# EAGLE design power (EAGLE 6.4)
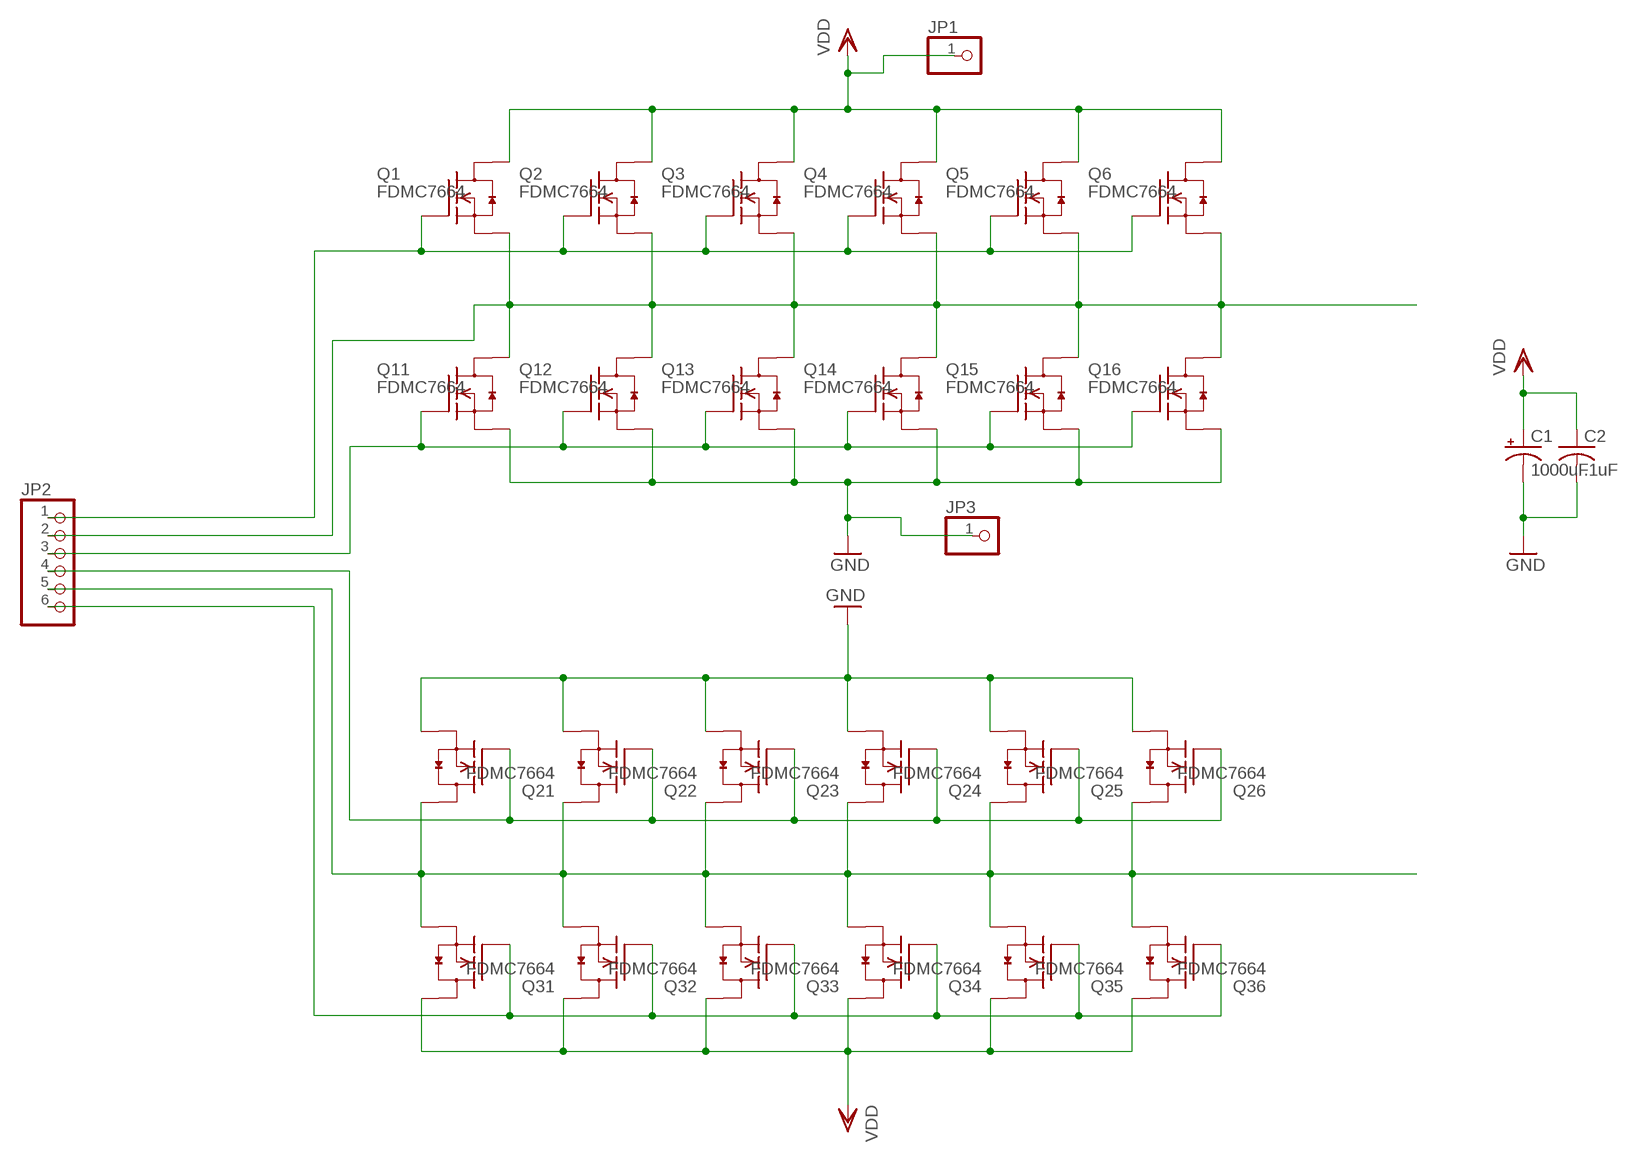
[diagram p0: schematic, sheet 1]

## Parts
C1  1000uF  CPOL-US140CLH-0810  [140CLH-0810]
C2  .1uF  C-USC0603  [C0603]
JP1  PINHD-1X1  [1X01]
JP2  PINHD-1X6  [1X06]
JP3  PINHD-1X1  [1X01]
Q1  FDMC7664  [MLP33]
Q2  FDMC7664  [MLP33]
Q3  FDMC7664  [MLP33]
Q4  FDMC7664  [MLP33]
Q5  FDMC7664  [MLP33]
Q6  FDMC7664  [MLP33]
Q11  FDMC7664  [MLP33]
Q12  FDMC7664  [MLP33]
Q13  FDMC7664  [MLP33]
Q14  FDMC7664  [MLP33]
Q15  FDMC7664  [MLP33]
Q16  FDMC7664  [MLP33]
Q21  FDMC7664  [MLP33]
Q22  FDMC7664  [MLP33]
Q23  FDMC7664  [MLP33]
Q24  FDMC7664  [MLP33]
Q25  FDMC7664  [MLP33]
Q26  FDMC7664  [MLP33]
Q31  FDMC7664  [MLP33]
Q32  FDMC7664  [MLP33]
Q33  FDMC7664  [MLP33]
Q34  FDMC7664  [MLP33]
Q35  FDMC7664  [MLP33]
Q36  FDMC7664  [MLP33]

## Nets
GND: C1.- C2.2 JP3.1 Q11.123S(S) Q12.123S(S) Q13.123S(S) Q14.123S(S) Q15.123S(S) Q16.123S(S) Q21.123S(S) Q22.123S(S) Q23.123S(S) Q24.123S(S) Q25.123S(S) Q26.123S(S)
HO_1: JP2.1 Q1.4G(G) Q2.4G(G) Q3.4G(G) Q4.4G(G) Q5.4G(G) Q6.4G(G)
HO_2: JP2.6 Q31.4G(G) Q32.4G(G) Q33.4G(G) Q34.4G(G) Q35.4G(G) Q36.4G(G)
LO_1: JP2.3 Q11.4G(G) Q12.4G(G) Q13.4G(G) Q14.4G(G) Q15.4G(G) Q16.4G(G)
LO_2: JP2.4 Q21.4G(G) Q22.4G(G) Q23.4G(G) Q24.4G(G) Q25.4G(G) Q26.4G(G)
MOTOR_OUT_1: JP2.2 Q1.123S(S) Q2.123S(S) Q3.123S(S) Q4.123S(S) Q5.123S(S) Q6.123S(S) Q11.5678D(D) Q12.5678D(D) Q13.5678D(D) Q14.5678D(D) Q15.5678D(D) Q16.5678D(D)
MOTOR_OUT_2: JP2.5 Q21.5678D(D) Q22.5678D(D) Q23.5678D(D) Q24.5678D(D) Q25.5678D(D) Q26.5678D(D) Q31.123S(S) Q32.123S(S) Q33.123S(S) Q34.123S(S) Q35.123S(S) Q36.123S(S)
VDD: C1.+ C2.1 JP1.1 Q1.5678D(D) Q2.5678D(D) Q3.5678D(D) Q4.5678D(D) Q5.5678D(D) Q6.5678D(D) Q31.5678D(D) Q32.5678D(D) Q33.5678D(D) Q34.5678D(D) Q35.5678D(D) Q36.5678D(D)

## Library data of the parts
C1 = rcl:CPOL-US: POLARIZED CAPACITOR, American symbol
C2 = rcl:C-US: CAPACITOR, American symbol
JP1 JP3 = pinhead:PINHD-1X1: PIN HEADER
JP2 = pinhead:PINHD-1X6: PIN HEADER
Q1-Q6 Q11-Q16 Q21-Q26 Q31-Q36 = open-bldc:FDMC7664

## Board
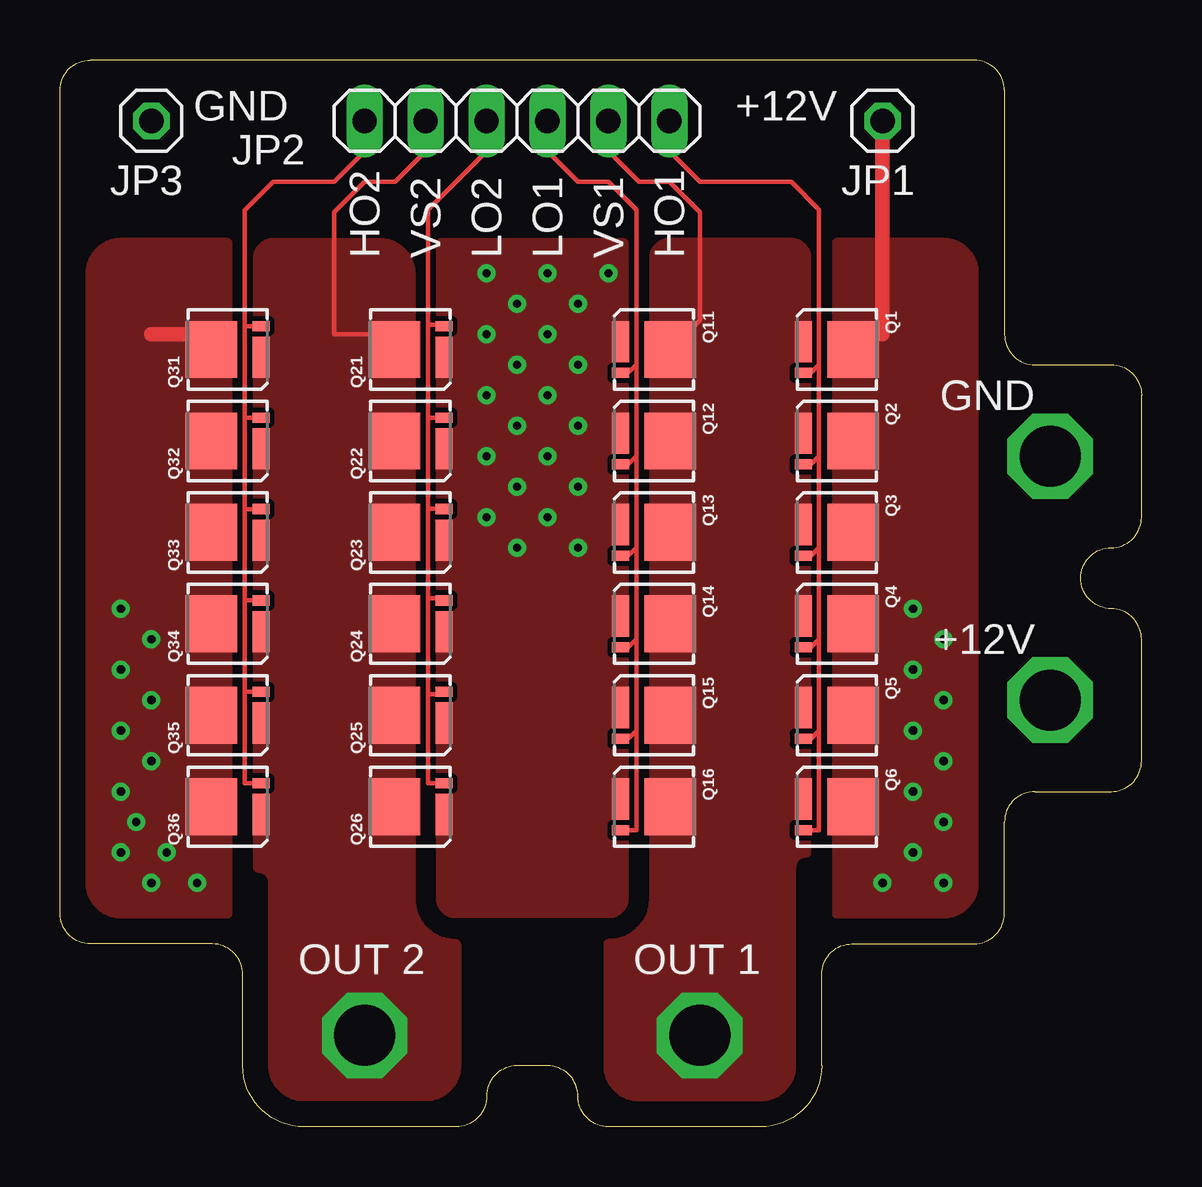
[diagram p1: board, top side]
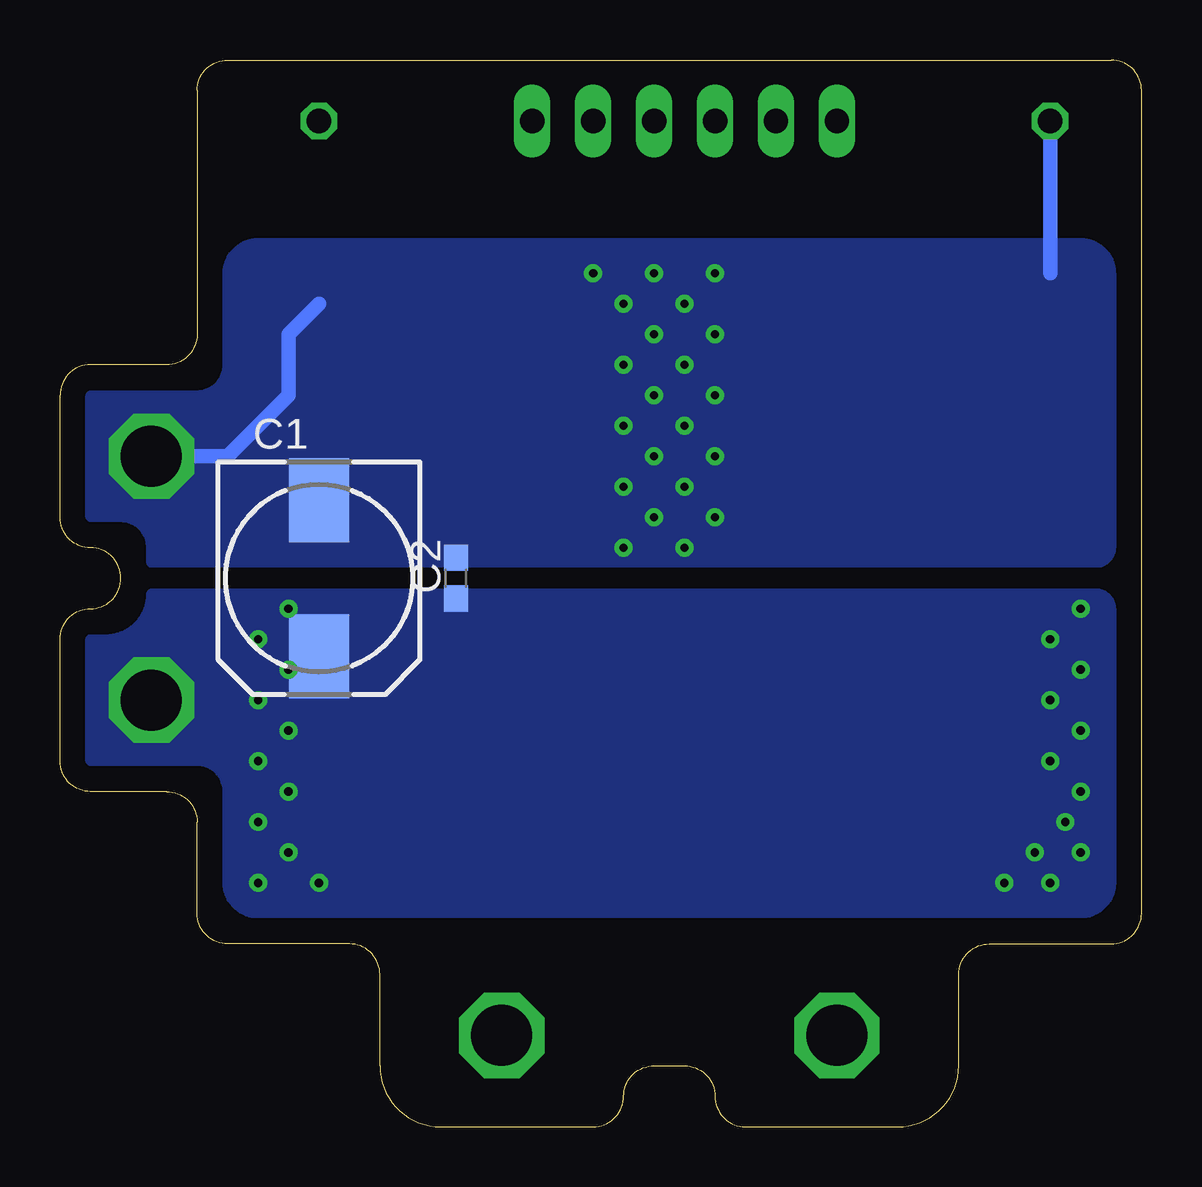
[diagram p2: board, bottom side, seen from below]

Size 45.09 x 44.45 mm. Coordinates in mm from the lower left corner, seen from the top.
Outline: 38.1,44.45 1.27,44.45 arc90 0,43.18 0,8.89 arc90 1.27,7.62 6.35,7.62 arc-90 7.62,6.35 7.62,2.54 arc90 10.16,0 16.51,0 arc90 17.78,1.27 arc-90 19.05,2.54 20.32,2.54 arc-90 21.59,1.27 arc90 22.86,0 29.21,0 arc90 31.75,2.54 31.75,6.35 arc-90 33.02,7.62 38.1,7.62 arc90 39.37,8.89 39.37,12.7 arc-90 40.64,13.97 43.82,13.97 arc90 45.09,15.24 45.09,20.32 arc90 43.82,21.59 arc-90 42.54,22.86 arc-90 43.82,24.13 arc90 45.09,25.4 45.09,30.48 arc90 43.82,31.75 40.64,31.75 arc-90 39.37,33.02 39.37,43.18 arc90 38.1,44.45
Copper layers (1*16): Top 0.035mm / dielectric 1.5mm / Bottom 0.035mm
Design rules "default *": minimum track width 10mil, minimum drill 24mil, track to track 8mil, track to pad 8mil, pad to pad 8mil, via to via 8mil, smd to smd 8mil, copper to edge 40mil, drill to drill 8mil, minimum pad ring 10mil, minimum via ring 8mil, stop-mask expansion 4mil, vias tented up to drill 25mil, thermal gap 10mil

### Footprints (pad centres in the part's own frame; a part is rotated, then mirrored left to right if it is on the bottom)
140CLH-0810 = smd 3.5 x 2.5: + 3.25,0; - -3.25,0
C0603 = smd 1.1 x 1: 1 -0.85,0; 2 0.85,0
1X01 = drill 1.016 octagon: 1 0,0
1X06 = drill 1.016 long: 1 -6.35,0; 2 -3.81,0; 3 -1.27,0; 4 1.27,0; 5 3.81,0; 6 6.35,0
MLP33 = smd 0.42 x 0.7: 4G 0.975,-1.4 | smd 1.72 x 0.7: 123S -0.325,-1.4 | smd 2.37 x 2.15: 5678D 0,0.675

### Placement (x,y rotation side)
C1  34.29,22.86 270 bottom
C2  28.58,22.86 90 bottom
JP1  34.29,41.91 180 top
JP2  19.05,41.91 180 top
JP3  3.81,41.91 180 top
Q1  32.38,32.38 270 top
Q2  32.38,28.57 270 top
Q3  32.38,24.77 270 top
Q4  32.38,20.95 270 top
Q5  32.38,17.14 270 top
Q6  32.38,13.34 270 top
Q11  24.77,32.38 270 top
Q12  24.77,28.57 270 top
Q13  24.77,24.77 270 top
Q14  24.77,20.95 270 top
Q15  24.77,17.14 270 top
Q16  24.77,13.34 270 top
Q21  14.61,32.38 90 top
Q22  14.61,28.57 90 top
Q23  14.61,24.77 90 top
Q24  14.61,20.95 90 top
Q25  14.61,17.14 90 top
Q26  14.61,13.34 90 top
Q31  6.98,32.38 90 top
Q32  6.98,28.57 90 top
Q33  6.98,24.77 90 top
Q34  6.98,20.95 90 top
Q35  6.98,17.14 90 top
Q36  6.98,13.34 90 top

### Tracks (layer width: path | path; a pad name or v marks a point on that pad's centre or on a via)
GND  (via drill 0.34, 2.54)
  Bottom 0.61: 34.29,34.29 35.56,33.02 35.56,30.48 38.1,27.94 v41.27,27.94 | JP3.1 3.81,35.56
  other vias: 21.59,24.13 19.05,24.13 20.32,25.4 17.78,25.4 21.59,26.67 19.05,26.67 20.32,27.94 17.78,27.94 19.05,29.21 21.59,29.21 20.32,30.48 17.78,30.48 21.59,31.75 19.05,31.75 20.32,33.02 17.78,33.02 21.59,34.29 19.05,34.29 22.86,35.56 20.32,35.56 17.78,35.56
  pour Bottom (no thermals): 43.82,30.48 39.37,30.48 arc-90 38.1,31.75 38.1,35.56 arc90 36.83,36.83 2.54,36.83 arc90 1.27,35.56 1.27,24.13 arc90 1.91,23.49 41.27,23.49 41.27,24.13 arc-90 42.54,25.4 43.82,25.4
  pour Top (no thermals): 23.49,36.83 23.49,9.53 arc-90 22.86,8.89 16.51,8.89 arc-90 15.88,9.53 15.88,36.83
HO_1
  Top 0.178: Q6.4G 31.65,12.36 31.65,16.51 | 31.65,16.51 31.65,20.32 | 31.65,20.32 31.65,24.13 | 31.65,24.13 31.65,27.94 | 31.65,27.94 31.65,31.75 | 31.65,31.75 31.65,38.2 30.48,39.37 26.67,39.37 25.4,40.64 JP2.1 | Q5.4G 31.3,16.17 31.65,16.51 | Q4.4G 31.3,19.98 31.65,20.32 | Q3.4G 31.3,23.79 31.65,24.13 | Q2.4G 31.3,27.6 31.65,27.94 | Q1.4G 31.3,31.41 31.65,31.75
HO_2
  Top 0.178: Q36.4G 7.7,14.31 7.7,17.78 7.7,18.12 | 7.7,18.12 7.7,21.93 | 7.7,21.93 7.7,25.74 | 7.7,25.74 7.7,29.55 | 7.7,29.55 7.7,33.36 | 7.7,33.36 7.7,38.19 8.89,39.37 11.43,39.37 12.7,40.64 JP2.6 | Q31.4G 7.7,33.36 | Q32.4G 7.7,29.55 | Q33.4G 7.7,25.74 | Q34.4G 7.7,21.93 | Q35.4G 7.7,18.12
LO_1
  Top 0.178: Q16.4G 24.02,12.36 24.02,16.51 | 24.02,16.51 24.02,20.32 | 24.02,20.32 24.02,24.13 | 24.02,24.13 24.02,27.94 | 24.02,27.94 24.02,31.75 | 24.02,31.75 24.02,38.2 22.86,39.37 21.59,39.37 20.32,40.64 JP2.3 | Q15.4G 23.69,16.17 24.02,16.51 | Q14.4G 23.69,19.98 24.02,20.32 | Q13.4G 23.69,23.79 24.02,24.13 | Q12.4G 23.69,27.6 24.02,27.94 | Q11.4G 23.69,31.41 24.02,31.75
LO_2
  Top 0.178: Q26.4G 15.34,14.31 15.34,18.01 | 15.34,18.01 15.34,22.02 | 15.34,22.02 15.34,25.74 | 15.34,25.74 15.34,29.55 | 15.34,29.55 15.34,33.41 | 15.34,33.41 15.34,38.2 17.78,40.64 JP2.4 | Q25.4G 15.9,18.01 15.34,18.01 | Q24.4G 15.91,22.02 15.34,22.02 | Q23.4G 15.34,25.74 | Q22.4G 15.34,29.55 | Q21.4G 15.95,33.41 15.34,33.41
MOTOR_OUT_1  (via drill 2.54)
  Top 0.178: JP2.2 22.86,40.64 24.13,39.37 25.4,39.37 26.67,38.1 26.67,33.62 Q11.5678D
  other vias: 26.67,3.81
  pour Top (no thermals): 24.77,36.2 24.77,9.53 arc-90 22.86,7.62 22.86,2.54 arc90 24.13,1.27 29.21,1.27 arc90 30.48,2.54 30.48,10.8 arc-90 31.12,11.43 31.12,36.2 arc90 30.48,36.83 25.4,36.83 arc90
MOTOR_OUT_2  (via drill 2.54)
  Top 0.178: JP2.5 15.24,40.64 13.97,39.37 12.7,39.37 11.43,38.1 11.43,33.02 13.3,33.02 Q21.5678D
  other vias: 12.7,3.81
  pour Top (no thermals): 16.51,7.62 16.51,2.54 arc-90 15.24,1.27 10.16,1.27 arc-90 8.89,2.54 8.89,10.16 arc90 8.26,10.8 8.26,36.2 arc-90 8.89,36.83 13.34,36.83 arc-90 14.61,35.56 14.61,9.53 arc90
VDD  (via drill 0.34, 2.54)
  Top 0.61: 3.81,33.02 5.68,33.02 Q31.5678D | JP1.1 34.29,33.02
  other vias: 41.27,17.78 5.72,10.16 3.81,10.16 4.45,11.43 2.54,11.43 3.18,12.7 2.54,13.97 3.81,15.24 2.54,16.51 3.81,17.78 2.54,19.05 3.81,20.32 2.54,21.59 36.83,10.16 34.29,10.16 35.56,11.43 36.83,12.7 35.56,13.97 36.83,15.24 35.56,16.51 36.83,17.78 35.56,19.05 36.83,20.32 35.56,21.59
  pour Bottom (no thermals): 43.82,15.24 43.82,20.32 43.18,20.32 arc-90 41.27,22.22 1.91,22.22 arc90 1.27,21.59 1.27,10.16 arc90 2.54,8.89 36.83,8.89 arc90 38.1,10.16 38.1,13.97 arc-90 39.37,15.24
  pour Top (no thermals): 32.38,8.89 36.83,8.89 arc90 38.1,10.16 38.1,35.56 arc90 36.83,36.83 32.38,36.83
  pour Top (no thermals): 6.98,8.89 6.98,36.83 2.54,36.83 arc90 1.27,35.56 1.27,10.16 arc90 2.54,8.89

### Text on the board
tPlace: GND | +12V | HO2 | VS2 | LO2 | LO1 | VS1 | HO1 | GND | +12V | OUT 2 | OUT 1
tDocu: Components: | - FDMC7664 | 24